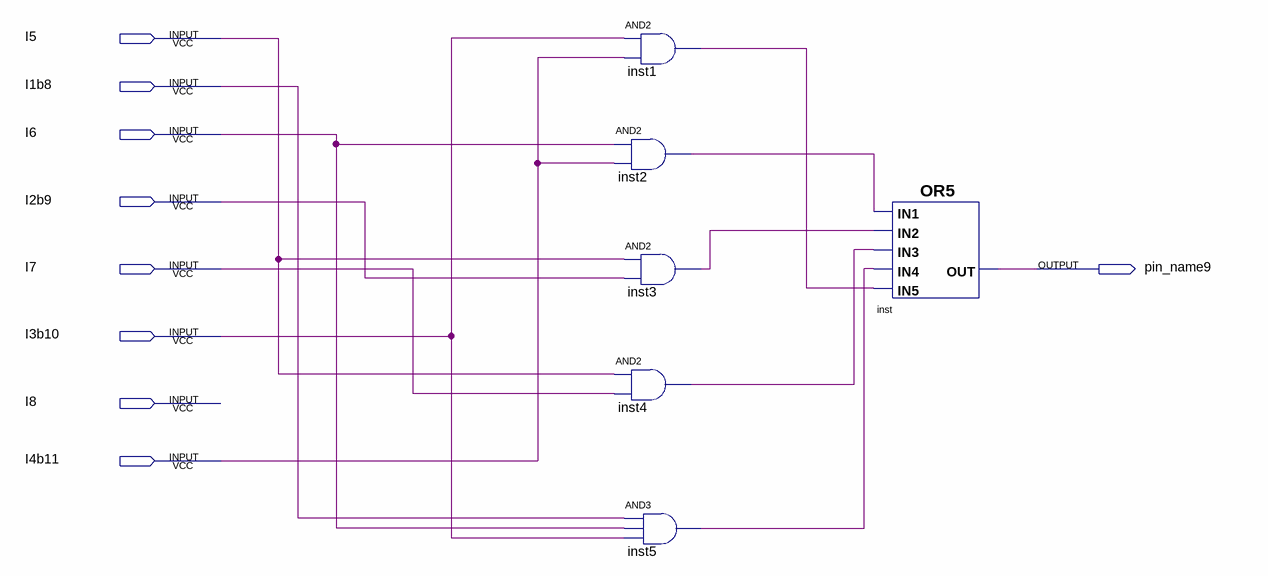
[diagram p0: schematic sheet]
// Quartus schematic funcf.bdf as structural Verilog: 6 symbols, 9 pins
module funcf (
  input  I5,
  input  I1b8,
  input  I6,
  input  I2b9,
  input  I7,
  input  I3b10,
  input  I8,
  input  I4b11,
  output pin_name9
);

  wire inst1_out, inst2_out, inst3_out, inst4_out, inst5_out;

  and inst1 (inst1_out, I3b10, I4b11);
  and inst2 (inst2_out, I6, I4b11);
  and inst3 (inst3_out, I5, I2b9);
  and inst4 (inst4_out, I5, I7);
  and inst5 (inst5_out, I1b8, I6, I3b10);
  or inst (pin_name9, inst2_out, inst3_out, inst4_out, inst5_out, inst1_out);
endmodule
